# Altium schematic sheet 7thCompetition_Send.SchDoc
size A4
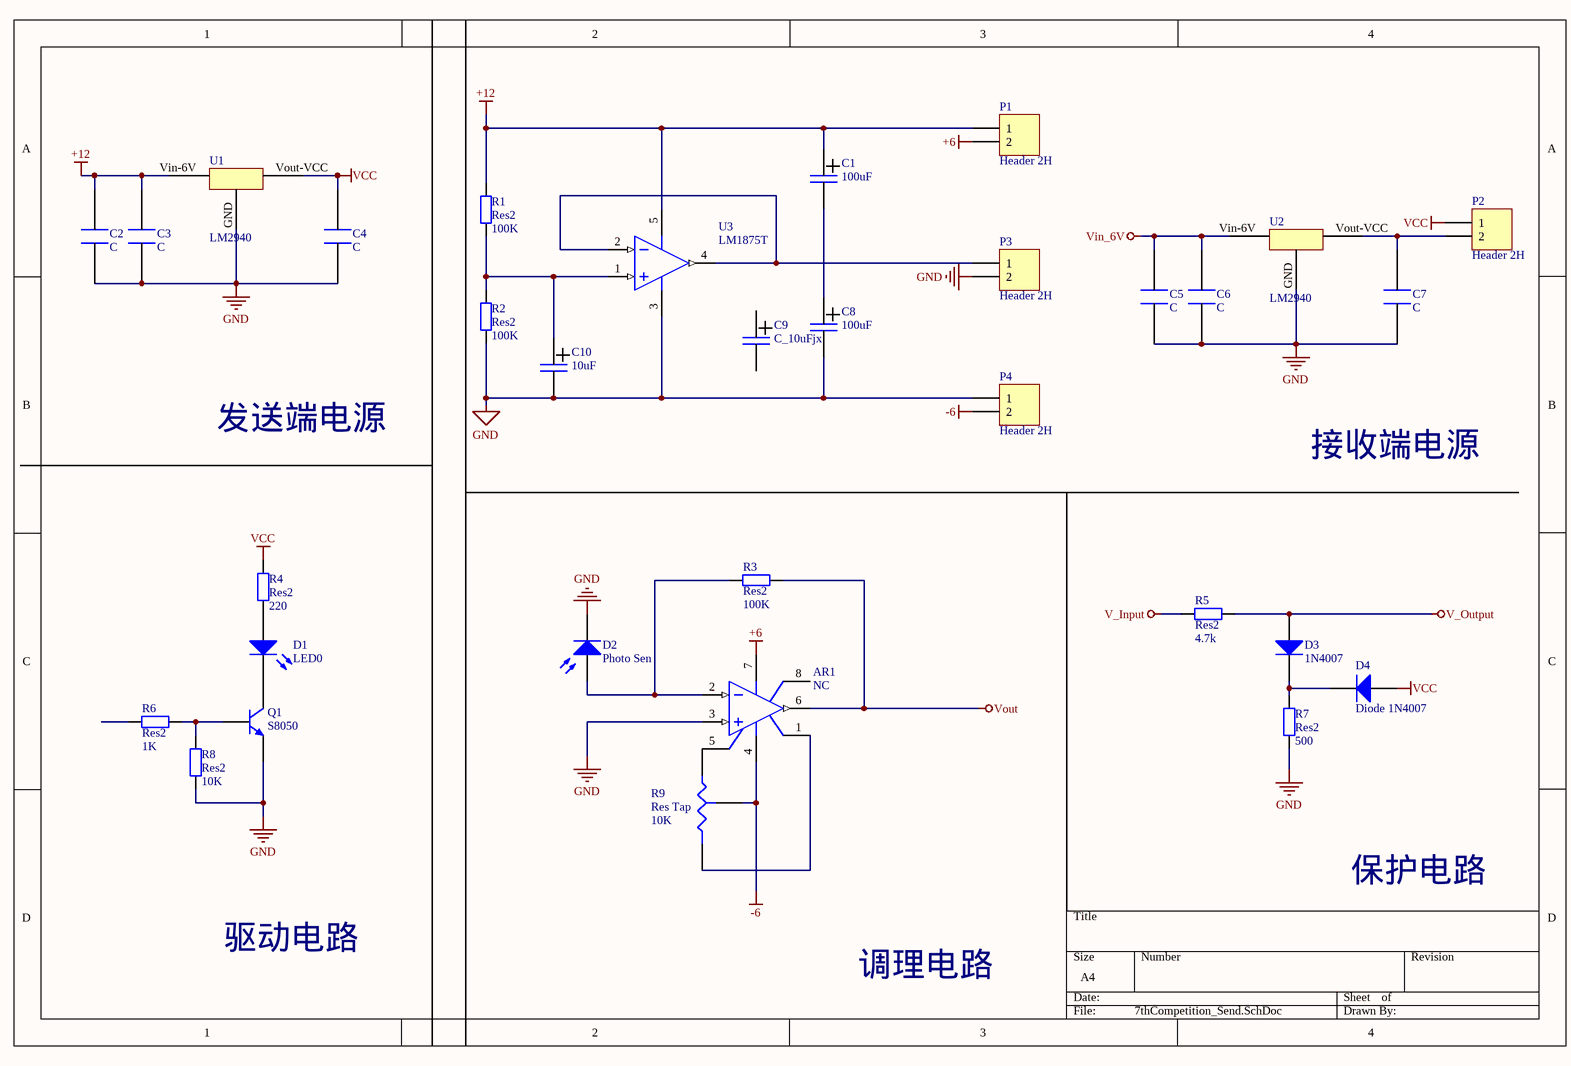
[diagram p0: 7thCompetition_Send.SchDoc]

## Parts
AR1  NC  [H-08A]
C1  100uF  [C_10uFJX]
C2  C  [C]
C3  C  [C]
C4  C  [C]
C5  C  [C]
C6  C  [C]
C7  C  [C]
C8  100uF  [C_10uFJX]
C9  C_10uFjx  [C_10uFJX]
C10  10uF  [C_10uFJX]
D1  LED0  [LED-0]
D2  Photo Sen  [PIN2]
D3  1N4007  [DO-41]
D4  Diode 1N4007  [DO-41]
P1  Header 2H  [HDR1X2H]
P2  Header 2H  [HDR1X2H]
P3  Header 2H  [HDR1X2H]
P4  Header 2H  [HDR1X2H]
Q1  S8050  [TO-92A]
R1  Res2  value 100K  [AXIAL-0.4]
R2  Res2  value 100K  [AXIAL-0.4]
R3  Res2  value 100K  [AXIAL-0.4]
R4  Res2  value 220  [AXIAL-0.4]
R5  Res2  value 4.7k  [AXIAL-0.4]
R6  Res2  value 1K  [AXIAL-0.4]
R7  Res2  value 500  [AXIAL-0.4]
R8  Res2  value 10K  [AXIAL-0.4]
R9  Res Tap  value 10K  [VR3]
U1  LM2940  [LM2940_DIP]
U2  LM2940  [LM2940_DIP]
U3  LM1875T  [TI-NDH5]

## Nets
+6: AR1.7(V+) P1.2
+12: C1.1 C2.2 C3.1 P1.1 R1.2 U1.Vin-6V(Vin) U3.5(VCC)
-6: AR1.4(V-) P4.2 R9.3(TAP)
GND: AR1.3(IN+) C2.1 C3.2 C4.1 C5.1 C6.2 C7.1 C8.2 C10.2 D2.2(K) P3.2 P4.1 Q1.1(E) R2.1 R7.1 R8.1 U1.GND(COM) U2.GND(COM) U3.3(VEE-)
V_Input: R5.1
V_Output: D3.1(A) R5.2
VCC: C4.2 D4.1(A) P2.1 R4.2 U1.Vout-VCC(Vout)
Vin_6V: C5.2 C6.1 U2.Vin-6V(Vin)
Vout: AR1.6(OUT) R3.2
NetAR1_1: AR1.1(OS_NUL) R9.2(B)
NetAR1_2: AR1.2(IN-) D2.1(A) R3.1
NetAR1_5: AR1.5(OS_NUL) R9.1(A)
NetC1_2: C1.2 C8.1
NetC7_2: C7.2 P2.2 U2.Vout-VCC(Vout)
NetC10_1: C10.1 R1.1 R2.2 U3.1(IN+)
NetD1_1: D1.1(A) R4.1
NetD1_2: D1.2(K) Q1.3(C)
NetD3_2: D3.2(K) D4.2(K) R7.2
NetP3_1: P3.1 U3.2(IN-) U3.4(OUT)
NetQ1_2: Q1.2(B) R6.2 R8.2

Not connected (* = marked no-connect by the designer): AR1 8(TAB); C9 1 2; R6 1

## Notes on the sheet
- 发送端电源
- 接收端电源
- 保护电路
- 驱动电路
- 调理电路

## Library data of the parts
AR1 = Op Amp: FET Operational Amplifier; Published: 8-Jun-2000; LatestRevisionDate: 17-Jul-2002; LatestRevisionNote: Re-released for DXP Platform.; DatasheetVersion: REV. B; PackageVersion: 1990; PackageReference: H-08A; Publisher: Altium Limited; PackageDescription: Can; 8 Leads; Pin Circle Dia. 5.08 mm; Lead Dia. 0.53 mm (max); ComponentLink1Description: Manufacturer Link; ComponentLink1URL: http://www.analog.com/
C1 C8 C10 = C_10uFjx
D1 = LED0: Typical INFRARED GaAs LED; Published: 8-Jun-2000; LatestRevisionDate: 08-Jul-2005; LatestRevisionNote: Mech Layer 1 removed.; PackageReference: LED-0; Publisher: Altium Limited; PackageDescription: LED; 2 Leads
D2 = Photo Sen: Photosensitive Diode; Published: 24-Mar-1999; LatestRevisionDate: 17-Jul-2002; LatestRevisionNote: Re-released for DXP Platform.; PackageReference: PIN2; Publisher: Altium Limited
D3 D4 = Diode 1N4007: 1 Amp General Purpose Rectifier; Published: 8-Jun-2000; LatestRevisionDate: 17-Jul-2002; LatestRevisionNote: Re-released for DXP Platform.; DatasheetVersion: 1998; PackageVersion: Aug-1999; PackageReference: DO-41; Publisher: Altium Limited; PackageDescription: Diode, Axial; Body 5.2 x 2.7 mm (LxDia. max), Lead Dia. 0.86 mm (max); Code_JEDEC: DO-204-AL; ComponentLink1Description: Manufacturer Link; ComponentLink1URL: http://www.fairchildsemi.com/; ComponentLink2Description: Datasheet; ComponentLink2URL: http://www.fairchildsemi.com/ds/1N%2F1N4001.pdf
P1-P4 = Header 2H: Header, 2-Pin, Right Angle; LatestRevisionDate: 17-Jul-2002; LatestRevisionNote: Re-released for DXP Platform.; Publisher: Altium Limited
Q1 = 2N3904: NPN General Purpose Amplifier; Published: 8-Jun-2000; LatestRevisionDate: 15-Jan-2003; LatestRevisionNote: PCB Footprint 'BCY-W3/D4.7' replaced; DatasheetVersion: 1997; PackageVersion: Sep-1998; PackageReference: TO-92A; Publisher: Altium Limited; PackageDescription: TO, Flat Index; 3 In-Line, Axial Leads; Body Dia. 4.5mm; Leads 0.51 x 0.48 mm (max); ComponentLink1Description: Manufacturer Link; ComponentLink1URL: http://www.fairchildsemi.com/; ComponentLink2Description: Datasheet; ComponentLink2URL: http://www.fairchildsemi.com/ds/2N%2F2N3904.pdf
R1-R8 = Res2: Resistor; Published: 8-Jun-2000; LatestRevisionDate: 17-Jul-2002; LatestRevisionNote: Re-released for DXP Platform.; PackageReference: AXIAL-0.4; Publisher: Altium Limited; PackageDescription: Axial Device, Thru-Hole; 2 Leads; 0.4 in Pin Spacing
R9 = Res Tap: Tapped Resistor; Sim Note: Enter the Resistance value and the set point into parameter fields.; Set Position: 0.5; Published: 24-Mar-1999; LatestRevisionDate: 17-Jul-2002; LatestRevisionNote: Re-released for DXP Platform.; PackageReference: VR3; Publisher: Altium Limited; PackageDescription: Variable Resistor, Thru-Hole; 3 Leads
U3 = LM1875T: 20 W Audio Power Amplifier, 0 to 70 degC, 5-pin FM (NDH5); Manufacturer: Texas Instruments; Analog Supply Max [V]: 60; Analog Supply Min [V]: 16; Input Type: Analog; Max. Number of Speaker Outputs: 1; SubFamily: Mid/High-Power Amplifier; DatasheetVersion: SNAS524A; PackageVersion: Rev. A, 02/2013; PackageReference: NDH5; PackageDescription: 5-Pin Metal Flange Mount, Body 10.16 x 4.57 mm, Pitch 1.7 mm; Supplier 1: Digi-Key; Supplier Part Number 1: 296-36099-5-ND; Supplier 2: Farnell; Supplier Part Number 2: 9488405; Supplier 3: Newark; Supplier Part Number 3: 92F268; Supplier 4: Mouser; Supplier Part Number 4: 926-LM1875T; Mounting Technology: Through Hole; PartNumber: LM1875T; ComponentLink1Description: Manufacturer URL; ComponentLink1URL: http://www.ti.com/; ComponentLink2Description: Datasheet; ComponentLink2URL: http://www.ti.com/general/docs/lit/getliterature.tsp?genericPartNumber=LM1875&fileType=pdf; ComponentLink3Description: Package Specification; ComponentLink3URL: http://www.ti.com/lit/ml/mmsf011/mmsf011.pdf